# Altium schematic sheet 水表通用工装一版1.SchDoc
size A3
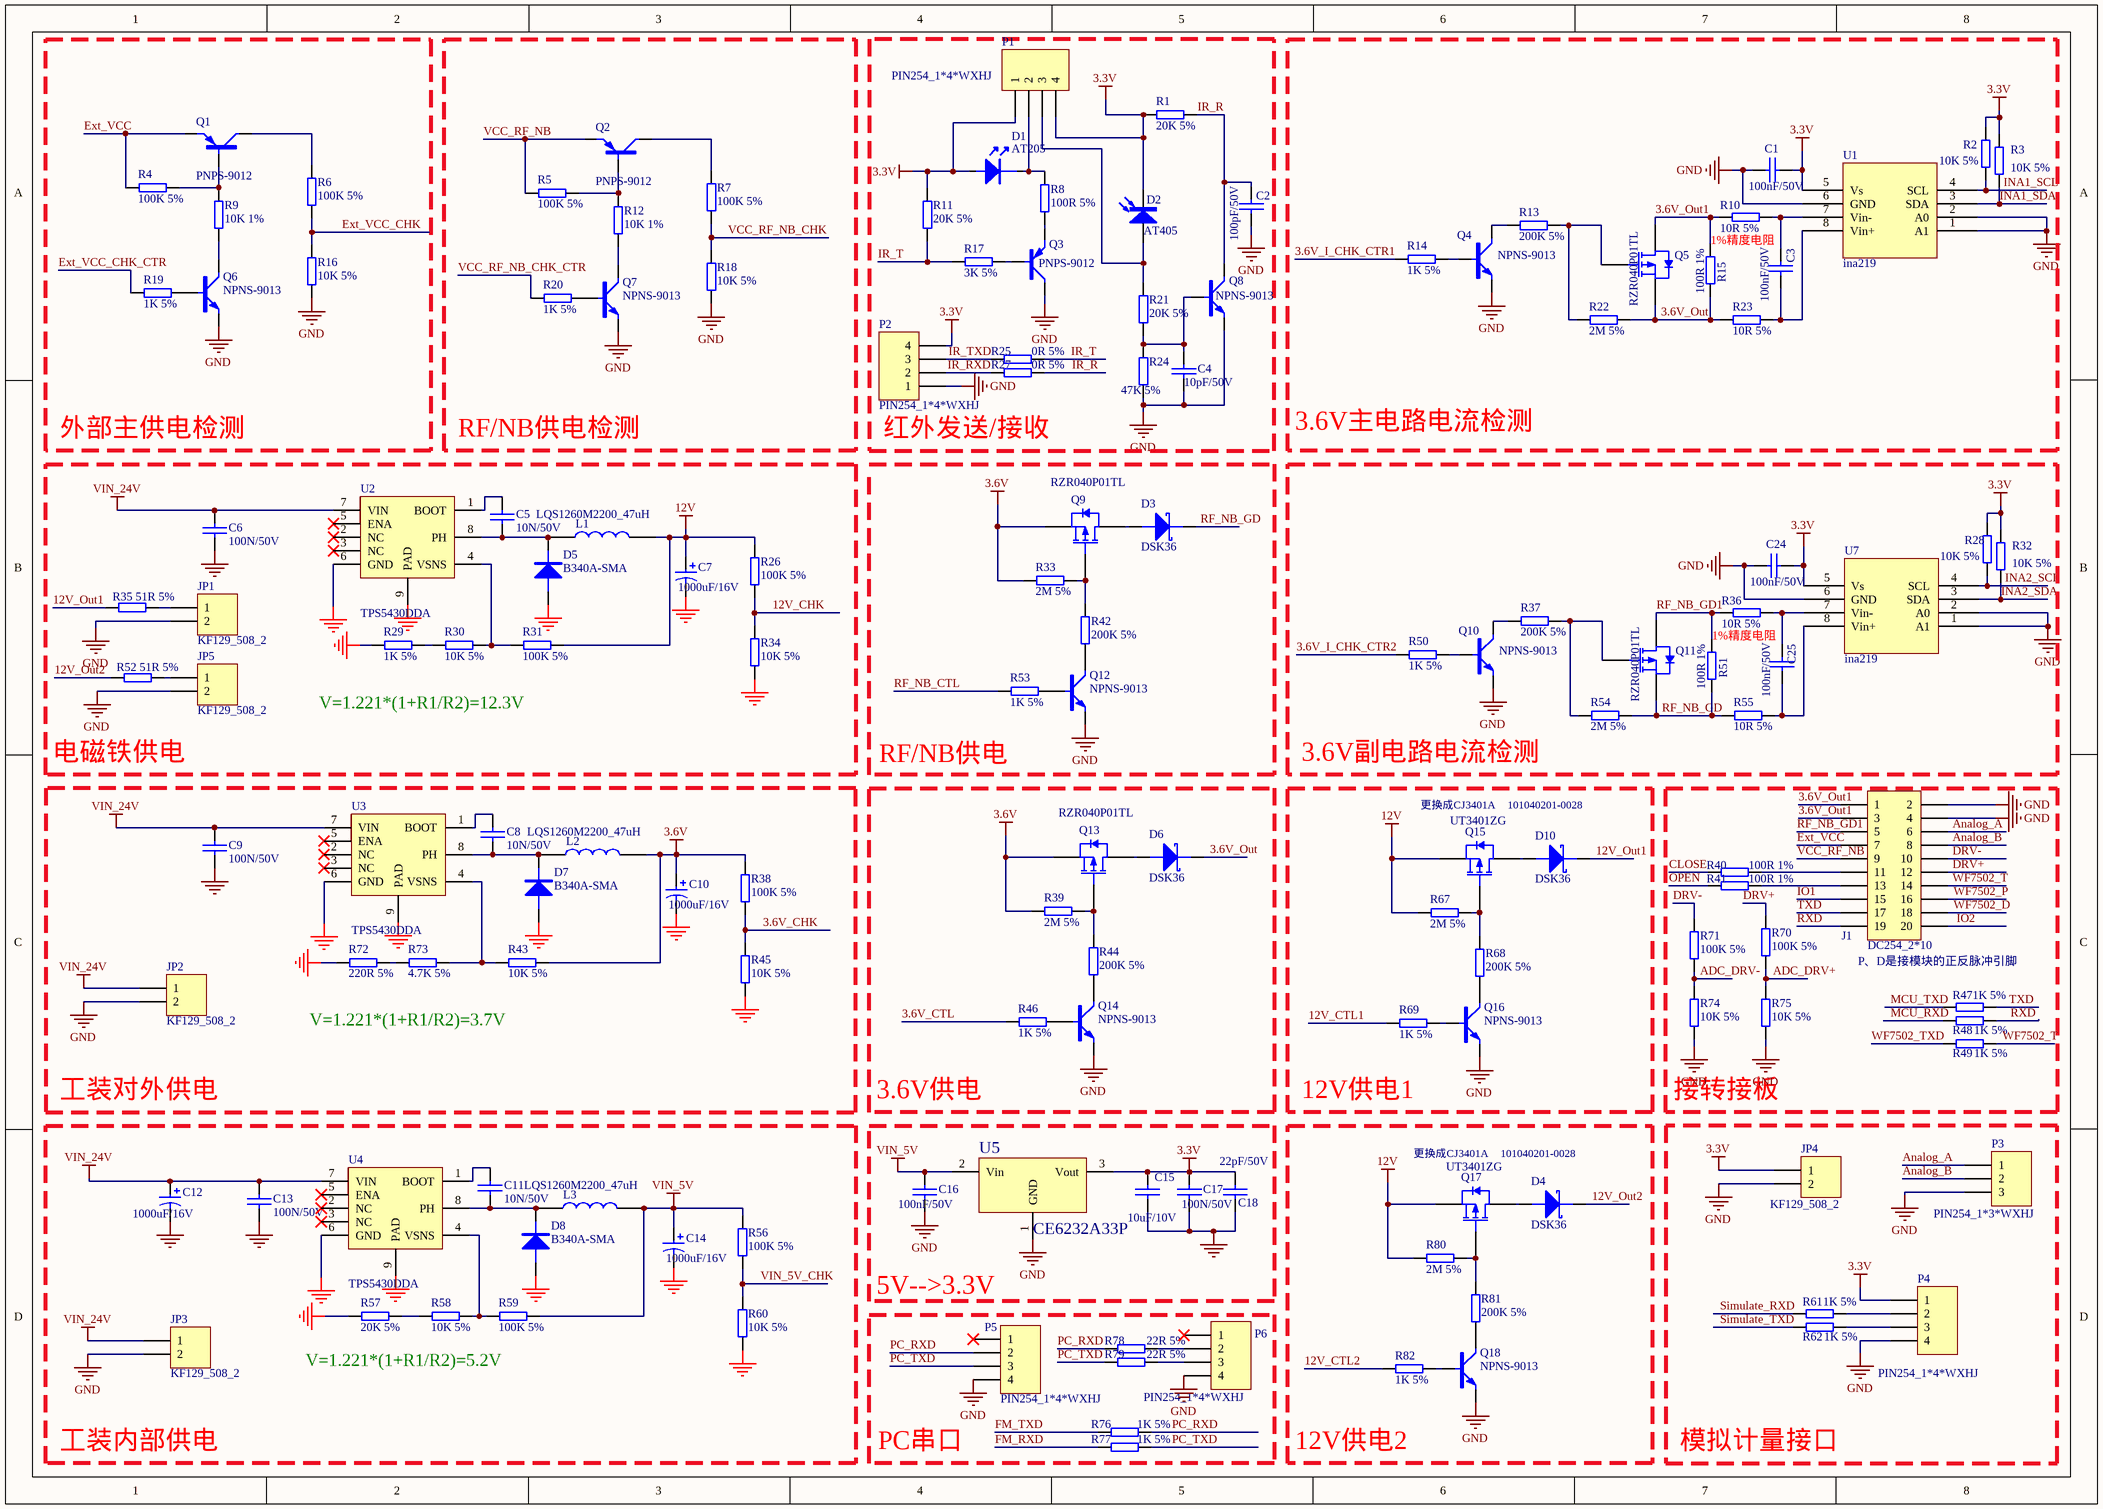
[diagram p0: 水表通用工装一版1.SchDoc]

## Parts
C1  100nF/50V  [CAP0603]
C2  100pF/50V  [CAP0603]
C3  100nF/50V  [CAP0603]
C4  10pF/50V  [CAP0603]
C5  10N/50V  [CAP0603]
C6  100N/50V  [CAP0603]
C7  1000uF/16V  [CAPPC_350_800_1600]
C8  10N/50V  [CAP0603]
C9  100N/50V  [CAP0603]
C10  1000uF/16V  [CAPPC_350_800_1600]
C11  10N/50V  [CAP0603]
C12  1000uF/16V  [CAPPC_350_800_1600]
C13  100N/50V  [CAP0603]
C14  1000uF/16V  [CAPPC_350_800_1600]
C15  10uF/10V  [CAP0603]
C16  100nF/50V  [CAP0603]
C17  100N/50V  [CAP0603]
C18  22pF/50V  [CAP0603]
C24  100nF/50V  [CAP0603]
C25  100nF/50V  [CAP0603]
D1  AT205  [AT205/405]
D2  AT405  [AT205/405]
D3  DSK36  [SOD-123FL]
D4  DSK36  [SOD-123FL]
D5  B340A-SMA  [DO-214AC]
D6  DSK36  [SOD-123FL]
D7  B340A-SMA  [DO-214AC]
D8  B340A-SMA  [DO-214AC]
D10  DSK36  [SOD-123FL]
J1  DC254_2*10  [DC254_2*10]
JP1  KF129_508_2  [KF129_508_2]
JP2  KF129_508_2  [KF129_508_2]
JP3  KF129_508_2  [KF129_508_2]
JP4  KF129_508_2  [KF129_508_2]
JP5  KF129_508_2  [KF129_508_2]
L1  LQS1260M2200_47uH  [LQS1212]
L2  LQS1260M2200_47uH  [LQS1212]
L3  LQS1260M2200_47uH  [LQS1212]
P1  PIN254_1*4*WXHJ  [PIN254_1*4*1100S]
P2  PIN254_1*4*WXHJ  [PIN254_1*4*1100S]
P3  PIN254_1*3*WXHJ  [PIN254_1*3*1100S - duplicate]
P4  PIN254_1*4*WXHJ  [PIN254_1*4*1100S]
P5  PIN254_1*4*WXHJ  [PIN254_1*4*1100S]
P6  PIN254_1*4*WXHJ  [PIN254_1*4*1100S]
Q1  PNPS-9012  [SOT-23]
Q2  PNPS-9012  [SOT-23]
Q3  PNPS-9012  [SOT-23]
Q4  NPNS-9013  [SOT-23]
Q5  RZR040P01TL  [SOT-23]
Q6  NPNS-9013  [SOT-23]
Q7  NPNS-9013  [SOT-23]
Q8  NPNS-9013  [SOT-23]
Q9  RZR040P01TL  [SOT-23]
Q10  NPNS-9013  [SOT-23]
Q11  RZR040P01TL  [SOT-23]
Q12  NPNS-9013  [SOT-23]
Q13  RZR040P01TL  [SOT-23]
Q14  NPNS-9013  [SOT-23]
Q15  UT3401ZG  [SOT-23]
Q16  NPNS-9013  [SOT-23]
Q17  UT3401ZG  [SOT-23]
Q18  NPNS-9013  [SOT-23]
R1  20K 5%  [RES0603]
R2  10K 5%  [RES0603]
R3  10K 5%  [RES0603]
R4  100K 5%  [RES0603]
R5  100K 5%  [RES0603]
R6  100K 5%  [RES0603]
R7  100K 5%  [RES0603]
R8  100R 5%  [RES0603]
R9  10K 1%  [RES0603]
R10  10R 5%  [RES0603]
R11  20K 5%  [RES0603]
R12  10K 1%  [RES0603]
R13  200K 5%  [RES0603]
R14  1K 5%  [RES0603]
R15  100R 1%  [RES0603]
R16  10K 5%  [RES0603]
R17  3K 5%  [RES0603]
R18  10K 5%  [RES0603]
R19  1K 5%  [RES0603]
R20  1K 5%  [RES0603]
R21  20K 5%  [RES0603]
R22  2M 5%  [RES0603]
R23  10R 5%  [RES0603]
R24  47K 5%  [RES0603]
R25  0R 5%  [RES0603]
R26  100K 5%  [RES0603]
R27  0R 5%  [RES0603]
R28  10K 5%  [RES0603]
R29  1K 5%  [RES0603]
R30  10K 5%  [RES0603]
R31  100K 5%  [RES0603]
R32  10K 5%  [RES0603]
R33  2M 5%  [RES0603]
R34  10K 5%  [RES0603]
R35  51R 5%  [RES0603]
R36  10R 5%  [RES0603]
R37  200K 5%  [RES0603]
R38  100K 5%  [RES0603]
R39  2M 5%  [RES0603]
R40  100R 1%  [RES0603]
R41  100R 1%  [RES0603]
R42  200K 5%  [RES0603]
R43  10K 5%  [RES0603]
R44  200K 5%  [RES0603]
R45  10K 5%  [RES0603]
R46  1K 5%  [RES0603]
R47  1K 5%  [RES0603]
R48  1K 5%  [RES0603]
R49  1K 5%  [RES0603]
R50  1K 5%  [RES0603]
R51  100R 1%  [RES0603]
R52  51R 5%  [RES0603]
R53  1K 5%  [RES0603]
R54  2M 5%  [RES0603]
R55  10R 5%  [RES0603]
R56  100K 5%  [RES0603]
R57  20K 5%  [RES0603]
R58  10K 5%  [RES0603]
R59  100K 5%  [RES0603]
R60  10K 5%  [RES0603]
R61  1K 5%  [RES0603]
R62  1K 5%  [RES0603]
R67  2M 5%  [RES0603]
R68  200K 5%  [RES0603]
R69  1K 5%  [RES0603]
R70  100K 5%  [RES0603]
R71  100K 5%  [RES0603]
R72  220R 5%  [RES0603]
R73  4.7K 5%  [RES0603]
R74  10K 5%  [RES0603]
R75  10K 5%  [RES0603]
R76  1K 5%  [RES0603]
R77  1K 5%  [RES0603]
R78  22R 5%  [RES0603]
R79  22R 5%  [RES0603]
R80  2M 5%  [RES0603]
R81  200K 5%  [RES0603]
R82  1K 5%  [RES0603]
U1  ina219  [SO-8]
U2  TPS5430DDA  [SOP-8-P]
U3  TPS5430DDA  [SOP-8-P]
U4  TPS5430DDA  [SOP-8-P]
U5  CE6232A33P  [SOT-89]
U7  ina219  [SO-8]

## Blocks framed on the sheet
外部主供电检测: Q1 Q6 R4 R6 R9 R16 R19
RF/NB供电检测: Q2 Q7 R5 R7 R12 R18 R20
红外发送/接收: C2 C4 D1 D2 P1 P2 Q3 Q8 R1 R8 R11 R17 R21 R24 R25 R27
3.6V主电路电流检测: C1 C3 Q4 Q5 R2 R3 R10 R13-R15 R22 R23 U1
电磁铁供电: C5-C7 D5 JP1 JP5 L1 R26 R29-R31 R34 R35 R52 U2
3.6V副电路电流检测: C24 C25 Q10 Q11 R28 R32 R36 R37 R50 R51 R54 R55 U7
工装对外供电: C8-C10 D7 JP2 L2 R38 R43 R45 R72 R73 U3
12V供电1: D10 Q15 Q16 R67-R69
接转接板: J1 R40 R41 R47-R49 R70 R71 R74 R75
工装内部供电: C11-C14 D8 JP3 L3 R56-R60 U4
5V-->3.3V: C15-C18 U5
12V供电2: D4 Q17 Q18 R80-R82
模拟计量接口: JP4 P3 P4 R61 R62

## Nets
3.3V: C1.2 C15.1 C17.1 C18.1 C24.2 D1.1 D2.2(K) JP4.1 P1.1 P1.4 P2.4 P4.1 R1.1 R2.1 R3.1 R11.2 R28.1 R32.1 U1.5(Vs) U5.3(Vout) U7.5(Vs)
3.6V: C10.1 L2.2 Q9.2(S) Q13.2(S) R33.1 R38.2 R39.1 R43.2
12V: C7.1 L1.2 Q15.2(S) Q17.2(S) R26.2 R31.2 R67.1 R80.1
GND: C1.1 C2.2 C4.2 C6.2 C7.2 C9.2 C10.2 C12.2 C13.2 C14.2 C15.2 C16.2 C17.2 C18.2 C24.1 D5.1 D7.1 D8.1 J1.2 J1.4 JP1.2 JP2.2 JP3.2 JP4.2 JP5.2 P2.1 P3.3 P4.4 P5.4 P6.4 Q3.3(C) Q4.2(E) Q6.2(E) Q7.2(E) Q8.2(E) Q10.2(E) Q12.2(E) Q14.2(E) Q16.2(E) Q18.2(E) R16.2 R18.2 R24.1 R29.1 R34.1 R45.1 R57.1 R60.1 R72.1 R74.1 R75.1 U1.1(A1) U1.2(A0) U1.6(GND) U2.6(GND) U2.9(PAD) U3.6(GND) U3.9(PAD) U4.6(GND) U4.9(PAD) U5.1(GND) U7.1(A1) U7.2(A0) U7.6(GND)
VIN_5V: C14.1 C16.1 L3.2 R56.2 R59.1 U5.2(Vin)
VIN_24V: C6.1 C9.1 C12.1 C13.1 JP2.1 JP3.1 U2.7(VIN) U3.7(VIN) U4.7(VIN)
3.6V_CHK: R38.1 R45.2
3.6V_CTL: R46.1
3.6V_I_CHK_CTR1: R14.2
3.6V_I_CHK_CTR2: R50.2
3.6V_Out: D6.2 Q5.2(S) R15.1 R22.2 R23.1
3.6V_Out1: J1.1 J1.3 Q5.3(D) R10.1 R15.2
12V_CHK: R26.1 R34.2
12V_CTL1: R69.1
12V_CTL2: R82.1
12V_Out1: D10.2 R35.1
12V_Out2: D4.2 R52.1
ADC_DRV+: R70.1 R75.2
ADC_DRV-: R71.1 R74.2
Analog_A: J1.6 P3.1
Analog_B: J1.8 P3.2
CLOSE: R40.1
DRV+: J1.12 R70.2
DRV-: J1.10 R71.2
Ext_VCC: J1.7 Q1.2(E) R4.2
Ext_VCC_CHK: R6.2 R16.1
Ext_VCC_CHK_CTR: R19.1
FM_RXD: R77.1
FM_TXD: R76.1
INA1_SCL: R2.2 U1.4(SCL)
INA1_SDA: R3.2 U1.3(SDA)
INA2_SCL: R28.2 U7.4(SCL)
INA2_SDA: R32.2 U7.3(SDA)
IO1: J1.15
IO2: J1.20
IR_R: C2.1 Q8.3(C) R1.2 R27.2
IR_RXD: P2.2 R27.1
IR_T: R11.1 R17.1 R25.2
IR_TXD: P2.3 R25.1
MCU_RXD: R48.1
MCU_TXD: R47.1
OPEN: R41.1
PC_RXD: P5.2 R76.2 R78.1
PC_TXD: P5.3 R77.2 R79.1
RF_NB_CTL: R53.1
RF_NB_GD: D3.2 Q11.2(S) R51.1 R54.2 R55.1
RF_NB_GD1: J1.5 Q11.3(D) R36.1 R51.2
RXD: J1.19 R48.2
Simulate_RXD: R61.1
Simulate_TXD: R62.1
TXD: J1.17 R47.2
VCC_RF_NB: J1.9 Q2.2(E) R5.2
VCC_RF_NB_CHK: R7.2 R18.1
VCC_RF_NB_CHK_CTR: R20.1
VIN_5V_CHK: R56.1 R60.2
WF7502_D: J1.18
WF7502_P: J1.16
WF7502_T: J1.14 R49.2
WF7502_TXD: R49.1
NetC3_1: C3.1 R10.2 U1.7(Vin-)
NetC3_2: C3.2 R23.2 U1.8(Vin+)
NetC4_1: C4.1 Q8.1(B) R21.1 R24.2
NetC5_1: C5.1 D5.2 L1.1 U2.8(PH)
NetC5_2: C5.2 U2.1(BOOT)
NetC8_1: C8.1 D7.2 L2.1 U3.8(PH)
NetC8_2: C8.2 U3.1(BOOT)
NetC11_1: C11.1 D8.2 L3.1 U4.8(PH)
NetC11_2: C11.2 U4.1(BOOT)
NetC25_1: C25.1 R36.2 U7.7(Vin-)
NetC25_2: C25.2 R55.2 U7.8(Vin+)
NetD1_2: D1.2 P1.2 R8.2
NetD2_1: D2.1(A) P1.3 R21.2
NetD3_1: D3.1 Q9.3(D)
NetD4_1: D4.1 Q17.3(D)
NetD6_1: D6.1 Q13.3(D)
NetD10_1: D10.1 Q15.3(D)
NetJ1_11: J1.11 R40.2
NetJ1_13: J1.13 R41.2
NetJP1_1: JP1.1 R35.2
NetJP5_1: JP5.1 R52.2
NetP4_2: P4.2 R61.2
NetP4_3: P4.3 R62.2
NetP6_2: P6.2 R78.2
NetP6_3: P6.3 R79.2
NetQ1_1: Q1.1(B) R4.1 R9.1
NetQ1_3: Q1.3(C) R6.1
NetQ2_1: Q2.1(B) R5.1 R12.1
NetQ2_3: Q2.3(C) R7.1
NetQ3_1: Q3.1(B) R17.2
NetQ3_2: Q3.2(E) R8.1
NetQ4_1: Q4.1(B) R14.1
NetQ4_3: Q4.3(C) R13.2
NetQ5_1: Q5.1(G) R13.1 R22.1
NetQ6_1: Q6.1(B) R19.2
NetQ6_3: Q6.3(C) R9.2
NetQ7_1: Q7.1(B) R20.2
NetQ7_3: Q7.3(C) R12.2
NetQ9_1: Q9.1(G) R33.2 R42.2
NetQ10_1: Q10.1(B) R50.1
NetQ10_3: Q10.3(C) R37.2
NetQ11_1: Q11.1(G) R37.1 R54.1
NetQ12_1: Q12.1(B) R53.2
NetQ12_3: Q12.3(C) R42.1
NetQ13_1: Q13.1(G) R39.2 R44.2
NetQ14_1: Q14.1(B) R46.2
NetQ14_3: Q14.3(C) R44.1
NetQ15_1: Q15.1(G) R67.2 R68.2
NetQ16_1: Q16.1(B) R69.2
NetQ16_3: Q16.3(C) R68.1
NetQ17_1: Q17.1(G) R80.2 R81.2
NetQ18_1: Q18.1(B) R82.2
NetQ18_3: Q18.3(C) R81.1
NetR29_2: R29.2 R30.1
NetR30_2: R30.2 R31.1 U2.4(VSNS)
NetR43_1: R43.1 R73.2 U3.4(VSNS)
NetR57_2: R57.2 R58.1
NetR58_2: R58.2 R59.2 U4.4(VSNS)
NetR72_2: R72.2 R73.1

Not connected (* = marked no-connect by the designer): P5 1*; P6 1*; U2 2(NC)* 3(NC)* 5(ENA)*; U3 2(NC)* 3(NC)* 5(ENA)*; U4 2(NC)* 3(NC)* 5(ENA)*

## Notes on the sheet
- (near R15) 1%精度电阻
- (near R51) 1%精度电阻
- V=1.221*(1+R1/R2)=12.3V
- RF/NB供电
- 更换成CJ3401A    101040201-0028
- P、D是接模块的正反脉冲引脚
- V=1.221*(1+R1/R2)=3.7V
- 3.6V供电
- V=1.221*(1+R1/R2)=5.2V
- PC串口

## Library data of the parts
C1 C3 C16 C24 C25 = 101020103-0021: 104pF,50 V,±10%,0603,国巨,CC0603KRX7R9BB104; Part Name: 0603贴片电容; ID: 3; SMD/DIP: SMD; Part Number: 101020103-0021
C2 = 101020103-0010: 101pf,50 V,±5%,0603,国巨,CC0603JRNP09BN101; Part Name: 0603贴片电容; ID: 4; SMD/DIP: SMD; Part Number: 101020103-0010
C4 = 101020103-0014: 10pF,50 V,±5%,0603,X7R,国巨,CC0603JRNPO9BN100; Part Name: 0603贴片电容; ID: 7; SMD/DIP: SMD; Part Number: 101020103-0014
C5 C8 C11 = 101020103-0007: 10N/50V，±10%，0603; Part Name: 0603贴片电容; ID: 35; Part Number: 101020103-0007
C6 C9 C13 C17 = 101020103-0021: 100N/50V，±10%，0603; Part Name: 0603贴片电容; ID: 34; Part Number: 101020103-0021
C7 C10 C12 C14 = 1010203-0029: 1000uF,16 V,±20%,8*20mm,Rubycon,16ZLH1000M; Part Name: 电解电容; ID: 2; SMD/DIP: DIP; Part Number: 1010203-0029
C15 = 101020103-0026: 106pF,10 V,±10%,0603,村田,GRM188R61A106KE47D; Part Name: 0603贴片电容; ID: 8; SMD/DIP: SMD; Part Number: 101020103-0026
C18 = 101020103-0009: 22pF,50 V,±5%,0603,国巨,CC0603JRNPO9BN22; Part Name: 0603贴片电容; ID: 16; SMD/DIP: SMD; Part Number: 101020103-0009
D2 = 6: 红外接收头，插件，红光，AT405_PD_01; Part Number: 101040102-0011; Part Name: 红外接收管; Manufacturer: 品观; ID: 6; SMD/DIP: DIP
D3 D4 D6 D10 = 101040101-0043: DSK14,SOD-123FL,1 A,40 V,28 V,台湾强茂集团苏州群鑫电子,DSK14; Part Name: 二极管; ID: 10; SMD/DIP: SMD; Part Number: 101040101-0043
D5 D7 D8 = 101040101-0014: Part Name: 贴片肖特基; ID: 24; Part Number: 101040101-0014
J1 = 1010902-0139: DC2 2.54mm 2x10pin,2.54mm间距，2x10pin，32×8.55×27.5mm,母头,双排,双排牛角座; Part Name: DC牛角座; ID: 4; SMD/DIP: DIP; Part Number: 1010902-0139
JP1-JP5 = 1010904-0015: KF129-2P,螺丝紧固,2,ABS,松涛; Part Name: 接线端子; ID: 7; SMD/DIP: DIP; Part Number: 1010904-0015
L1-L3 = 1010302-0007: 47uH/2.2A,±20%，0.072Ω，L1200X1200X600; Part Name: 贴片电感; ID: 3; Part Number: 1010302-0007
P1 P2 P4-P6 = AD_WXHJ_PinHeader_01: 1*4 ，Φ1.0 ，2.54mm，直脚,无需焊接器件; Part Name: 排针; ID: 16; SMD/DIP: DIP; Part Number: AD_WXHJ_PinHeader_01
P3 = AD_WXHJ_PinHeader_01: 1*3 ，Φ1.0 ，2.54mm，直脚,无需焊接器件; Part Name: 排针; ID: 16; SMD/DIP: DIP; Part Number: AD_WXHJ_PinHeader_01
Q1-Q3 = 101040201-0001: 9012,PNP,SOT-23,JCET;长电,S9012; Part Name: 贴片三极管; ID: 17; SMD/DIP: SMD; Part Number: 101040201-0001
Q4 Q6-Q8 Q10 Q12 Q14 Q16 Q18 = 101040201-0002: 9013,NPN,SOT-23,长电,S9013; Part Name: 贴片三极管; ID: 15; SMD/DIP: SMD; Part Number: 101040201-0002
Q5 Q9 Q11 Q13 = 101040201-0010: RZR040P01TL；1.5v导通,P-MOS,SOT-23,罗姆,RZR040P01TL; Part Name: PMOS管; ID: 18; SMD/DIP: SMD; Part Number: 101040201-0010
Q15 Q17 = 101040201-0013: UT3401ZG,P-MOS,SOT-23,UTC,UT3401ZG; Part Name: 功率MOS管; ID: 19; SMD/DIP: SMD; Part Number: 101040201-0013
R1 R11 R21 R57 = 101010103-0004: 国巨,±5%,0603,,155 ℃,-55 ℃,RC0603JR-0720KL,无铅,200 ppm/℃,1/10W,,20K; Part Name: 0603贴片电阻; ID: 15; SMD/DIP: SMD; Part Number: 101010103-0004
R2 R3 R16 R18 R28 R30 R32 R34 R43 R45 R58 R60 R74 R75 = 101010103-0003: 国巨,±5%,0603,,155 ℃,-55 ℃,RC0603JR-0710KL,无铅,200 ppm/℃,1/10W,,10K; Part Name: 0603贴片电阻; ID: 7; SMD/DIP: SMD; Part Number: 101010103-0003
R4-R7 R31 = 101010103-0005: 国巨,±5%,0603,,155 ℃,-55 ℃,RC0603JR-07100KL,无铅,100 ppm/℃,1/10W,,100K; Part Name: 0603贴片电阻; ID: 3; SMD/DIP: SMD; Part Number: 101010103-0005
R8 = 101010103-0022: 100R,±5%,1/10W,0603,国巨,RC0603JR-07100RL; Part Name: 0603贴片电阻; ID: 5; SMD/DIP: SMD; Part Number: 101010103-0022
R9 R12 = 101010103-0052: 10K±1%,1/10W,0603; Part Name: 0603贴片电阻; ID: 6; SMD/DIP: SMD; Part Number: 101010103-0052
R10 R23 R36 R55 = 101010103-0017: 10R,±5%,1/10W,0603,国巨,RC0603JR-0710RL; Part Name: 0603贴片电阻; ID: 8; SMD/DIP: SMD; Part Number: 101010103-0017
R13 R37 R42 R44 R68 R81 = 101010103-0034: 200K,±5%,1/10W,0603,国巨,RC0603JR-07200KL; Part Name: 0603贴片电阻; ID: 13; SMD/DIP: SMD; Part Number: 101010103-0034
R14 R19 R20 R29 R46-R50 R53 R61 R62 R69 R76 R77 R82 = 101010103-0008: 1K,±5%,1/10W,0603,国巨,RC0603JR-071KL; Part Name: 0603贴片电阻; ID: 10; SMD/DIP: SMD; Part Number: 101010103-0008
R15 R40 R41 R51 = 101010103-0041: 100Ω,±1%,1/10W,0603,国巨股份有限公司,RC0603FR-07100RL; Part Name: 0603贴片电阻; ID: 4; SMD/DIP: SMD; Part Number: 101010103-0041
R17 = 101010103-0006: 国巨,±5%,0603,,155 ℃,-55 ℃,RC0603JR-073KL,无铅,100 ppm/℃,1/10W,,3K; Part Name: 0603贴片电阻; ID: 23; SMD/DIP: SMD; Part Number: 101010103-0006
R22 R33 R39 R54 R67 R80 = 101010103-0025: 国巨,±5%,0603,,155 ℃,-55 ℃,RC0603JR-072ML,含铅,100 ppm/℃,1/10W,,2M; Part Name: 0603贴片电阻; ID: 20; SMD/DIP: SMD; Part Number: 101010103-0025
R24 = 101010103-0012: 47K,±5%,1/10W,0603,国巨,RC0603JR-0747KL; Part Name: 0603贴片电阻; ID: 26; SMD/DIP: SMD; Part Number: 101010103-0012
R25 R27 = 101010103-0001: 国巨,±5%,0603,,155 ℃,-55 ℃,RC0603J2-070RL,无铅,200 ppm/℃,1/10W,,0R; Part Name: 0603贴片电阻; ID: 1; SMD/DIP: SMD; Part Number: 101010103-0001
R26 R38 R56 R59 R70 R71 = 101010103-0005: 100K±5%,1/10W,0603; Part Name: 0603贴片电阻; ID: 30; Part Number: 101010103-0005
R35 R52 = 101010103-0037: 国巨,±5%,0603,,155 ℃,-55 ℃,RC0603JR-0751RL,无铅,100 ppm/℃,1/10W,,51欧; Part Name: 0603贴片电阻; ID: 29; SMD/DIP: SMD; Part Number: 101010103-0037
R72 = 101010103-0019: 220±5%,1/10W,0603,国巨,RC0603JR-07220RL; Part Name: 0603贴片电阻; ID: 16; SMD/DIP: SMD; Part Number: 101010103-0019
R73 = 101010103-0042: 4.7K±5%,1/10W,0603; Part Name: 0603贴片电阻; ID: 24; SMD/DIP: SMD; Part Number: 101010103-0042
R78 R79 = 101010103-0009: 国巨,±5%,0603,,155 ℃,-55 ℃,RC0603JR-0722RL,无铅,200 ppm/℃,1/10W,,22欧; Part Name: 0603贴片电阻; ID: 18; SMD/DIP: SMD; Part Number: 101010103-0009
U1 U7 = Component_2
U2-U4 = 101050101-0053: TPS5430DDA,SOP8,TI,TPS5430DDA; Part Name: 电源芯片; ID: 9; SMD/DIP: SMD; Part Number: 101050101-0053
U5 = 1010503-0029: CE6232-3.3,CE6232-3.3,SOT89-3,8V,1.8V,0.11V,3.3V,300mA,0.8uA,南京芯力微电子有限公司; Part Name: 线性稳压芯片; ID: 5; SMD/DIP: SMD; Part Number: 1010503-0029